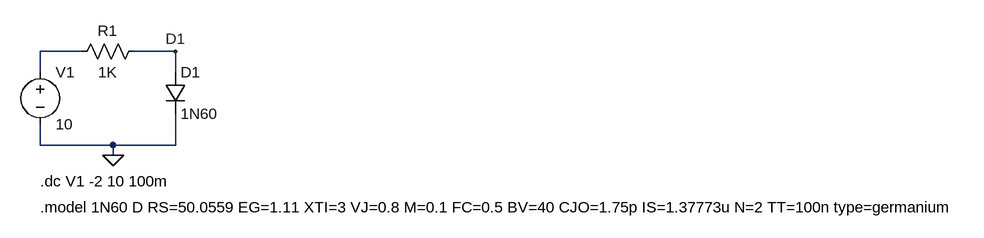
[diagram p0: schematic TP2_2.asc]
TP2_2.asc, the LTspice schematic file:
Version 4.1
SHEET 1 1652 680
WIRE 176 128 112 128
WIRE 320 128 256 128
WIRE 112 160 112 128
WIRE 320 160 320 128
WIRE 112 272 112 240
WIRE 224 272 112 272
WIRE 320 272 320 224
WIRE 320 272 224 272
WIRE 224 288 224 272
FLAG 224 288 0
FLAG 320 128 D1
SYMBOL res 272 112 R90
WINDOW 0 0 56 VBottom 2
WINDOW 3 32 56 VTop 2
SYMATTR InstName R1
SYMATTR Value 1K
SYMBOL diode 304 160 R0
SYMATTR InstName D1
SYMATTR Value 1N60
SYMBOL voltage 112 144 R0
WINDOW 123 0 0 Left 0
WINDOW 39 0 0 Left 0
SYMATTR InstName V1
SYMATTR Value 10
TEXT 112 328 Left 2 !.dc V1 -2 10 100m
TEXT 112 368 Left 2 !.model 1N60 D RS=50.0559 EG=1.11 XTI=3 VJ=0.8 M=0.1 FC=0.5 BV=40 CJO=1.75p IS=1.37773u N=2 TT=100n type=germanium

The netlist it stands for:
* TP2_2.asc
R1 D1 N001 1K
D1 D1 0 1N60
V1 N001 0 10
.model D D
.lib standard.dio
.dc V1 -2 10 100m
.model 1N60 D RS=50.0559 EG=1.11 XTI=3 VJ=0.8 M=0.1 FC=0.5 BV=40 CJO=1.75p IS=1.37773u N=2 TT=100n type=germanium
.backanno
.end